# Altium schematic sheet TTL Clock.SchDoc: TTL Clock
size A3; Date: 14/10/2015; Author: Danius Kalvaitis; Engineer: Danius Kalvaitis; Address1: L3, 12a Rodborough Rd; Address2: Frenchs Forest; Address3: NSW; Address4: Australia 2086; DocumentNumber: 0002; Revision: C; SheetNumber: 1; SheetTotal: 1; PageSetup: Record=PageOptions|CenterHorizontal=True|CenterVertical=True|PrintScale=0.73|XCorrection=1.00|YCorrection=1.00|PrintKind=1|BorderSize=5000000|LeftOffset=0|BottomOffset=0|Orientation=2|PaperLength=1000|PaperWidth=1000|Scale=100|PaperSource=15|PrintQuality=600|MediaType=1|DitherType=10|PrintScaleMode=1|PaperKind=A4|PaperIndex=9
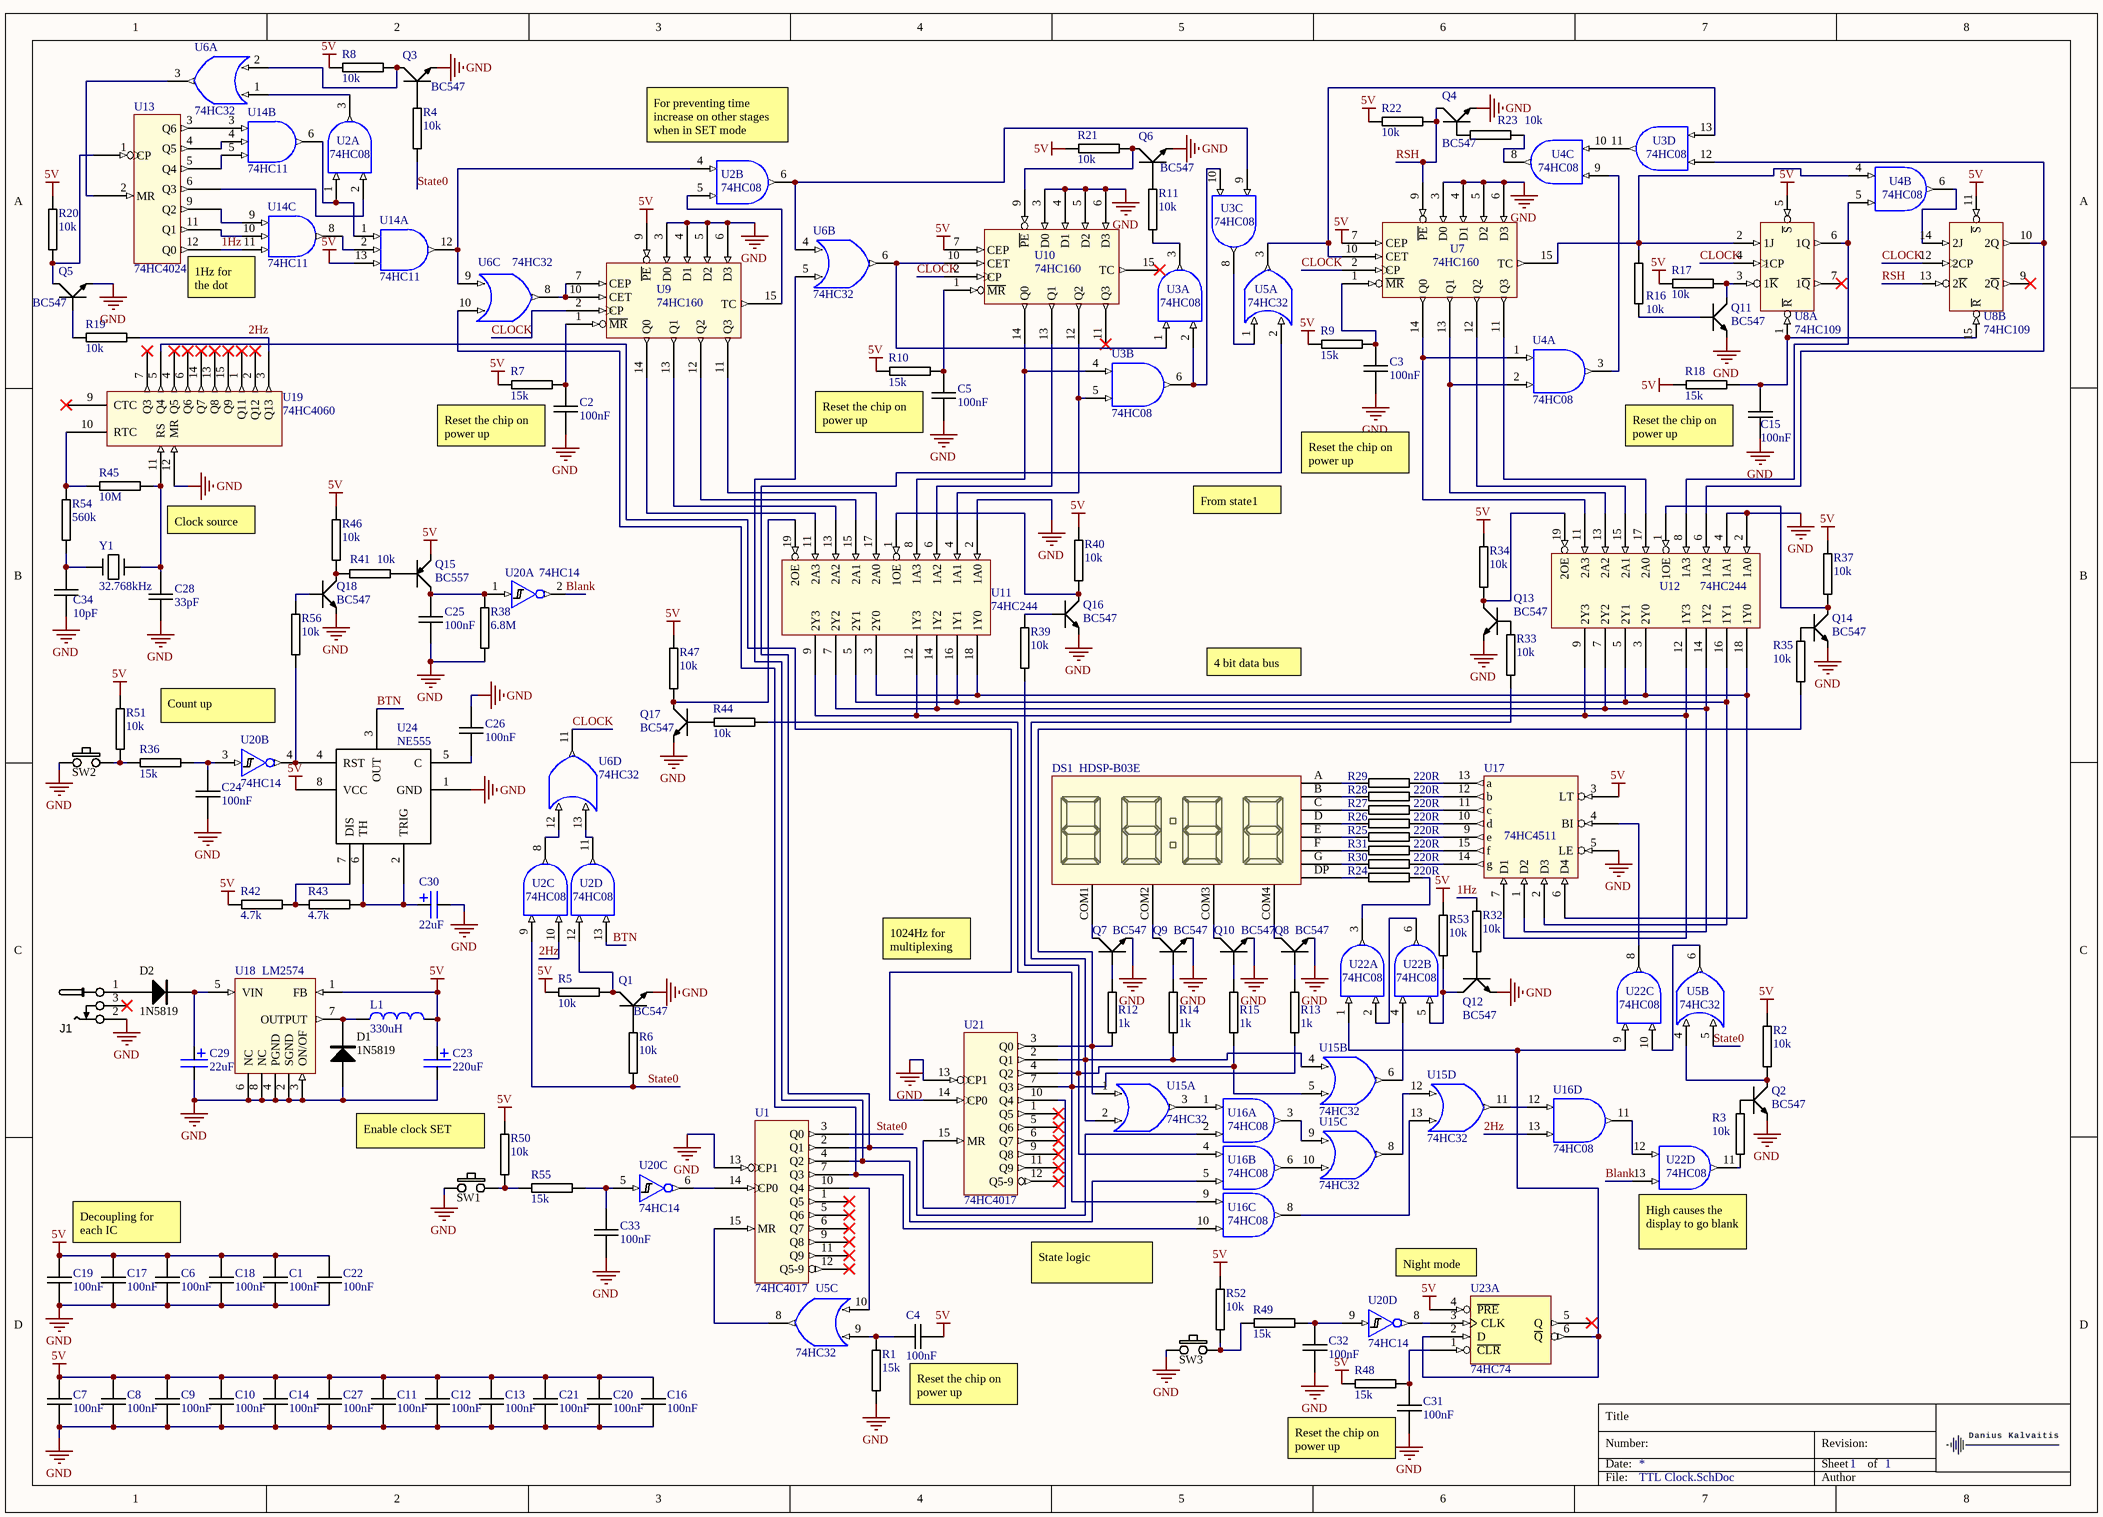
[diagram p0: TTL Clock.SchDoc]

## Parts
C1  100nF  [CTH radial 100mil]
C2  100nF  [CTH radial 100mil]
C3  100nF  [CTH radial 100mil]
C4  100nF  [CTH radial 100mil]
C5  100nF  [CTH radial 100mil]
C6  100nF  [CTH radial 100mil]
C7  100nF  [CTH radial 100mil]
C8  100nF  [CTH radial 100mil]
C9  100nF  [CTH radial 100mil]
C10  100nF  [CTH radial 100mil]
C11  100nF  [CTH radial 100mil]
C12  100nF  [CTH radial 100mil]
C13  100nF  [CTH radial 100mil]
C14  100nF  [CTH radial 100mil]
C15  100nF  [CTH radial 100mil]
C16  100nF  [CTH radial 100mil]
C17  100nF  [CTH radial 100mil]
C18  100nF  [CTH radial 100mil]
C19  100nF  [CTH radial 100mil]
C20  100nF  [CTH radial 100mil]
C21  100nF  [CTH radial 100mil]
C22  100nF  [CTH radial 100mil]
C23  220uF  [C_POL_Radial_220uF]
C24  100nF  [CTH radial 100mil]
C25  100nF  [CTH radial 100mil]
C26  100nF  [CTH radial 100mil]
C27  100nF  [CTH radial 100mil]
C28  33pF  [CTH radial 100mil]
C29  22uF  [C_Pol_Radial_22uF]
C30  22uF  [C_Pol_Radial_22uF]
C31  100nF  [CTH radial 100mil]
C32  100nF  [CTH radial 100mil]
C33  100nF  [CTH radial 100mil]
C34  10pF  [CTH radial 100mil]
D1  1N5819  [1N500X]
D2  1N5819  [1N500X]
DS1  HDSP-B03E  [LED DISPLAY 4x7seg clock red]
J1  CONN_PWR_JACK_2.1x5.5mm  [CONN_PWR_JACK_2.1x5.5mm]  (value not drawn)
L1  330uH  [ELC10D inductor]
Q1  BC547  [TO92]
Q2  BC547  [TO92]
Q3  BC547  [TO92]
Q4  BC547  [TO92]
Q5  BC547  [TO92]
Q6  BC547  [TO92]
Q7  BC547  [TO92]
Q8  BC547  [TO92]
Q9  BC547  [TO92]
Q10  BC547  [TO92]
Q11  BC547  [TO92]
Q12  BC547  [TO92]
Q13  BC547  [TO92]
Q14  BC547  [TO92]
Q15  BC557  [TO92]
Q16  BC547  [TO92]
Q17  BC547  [TO92]
Q18  BC547  [TO92]
R1  15k  [R-vertical]
R2  10k  [R-vertical]
R3  10k  [R-vertical]
R4  10k  [R-vertical]
R5  10k  [R-vertical]
R6  10k  [R-vertical]
R7  15k  [R-vertical]
R8  10k  [R-vertical]
R9  15k  [R-vertical]
R10  15k  [R-vertical]
R11  10k  [R-vertical]
R12  1k  [R-vertical]
R13  1k  [R-vertical]
R14  1k  [R-vertical]
R15  1k  [R-vertical]
R16  10k  [R-vertical]
R17  10k  [R-vertical]
R18  15k  [R-vertical]
R19  10k  [R-vertical]
R20  10k  [R-vertical]
R21  10k  [R-vertical]
R22  10k  [R-vertical]
R23  10k  [R-vertical]
R24  220R  [THR1/4-GENERIC]
R25  220R  [THR1/4-GENERIC]
R26  220R  [THR1/4-GENERIC]
R27  220R  [THR1/4-GENERIC]
R28  220R  [THR1/4-GENERIC]
R29  220R  [THR1/4-GENERIC]
R30  220R  [THR1/4-GENERIC]
R31  220R  [THR1/4-GENERIC]
R32  10k  [R-vertical]
R33  10k  [R-vertical]
R34  10k  [R-vertical]
R35  10k  [R-vertical]
R36  15k  [R-vertical]
R37  10k  [R-vertical]
R38  6.8M  [R-vertical]
R39  10k  [R-vertical]
R40  10k  [R-vertical]
R41  10k  [R-vertical]
R42  4.7k  [R-vertical]
R43  4.7k  [R-vertical]
R44  10k  [R-vertical]
R45  10M  [R-vertical]
R46  10k  [R-vertical]
R47  10k  [R-vertical]
R48  15k  [R-vertical]
R49  15k  [R-vertical]
R50  10k  [R-vertical]
R51  10k  [R-vertical]
R52  10k  [R-vertical]
R53  10k  [R-vertical]
R54  560k  [R-vertical]
R55  15k  [R-vertical]
R56  10k  [R-vertical]
SW1  SW-PB  [SW-PB-6x6-20]  (value not drawn)
SW2  SW-PB  [SW-PB-6x6-20]  (value not drawn)
SW3  SW-PB  [SW-PB-6x6-20]  (value not drawn)
U1  74HC4017  [DIP16]
U2  74HC08  [DIP14]  (parts A,B,C,D of 4)
U3  74HC08  [DIP14]  (parts A,B,C,D of 4)
U4  74HC08  [DIP14]  (parts A,B,C of 4)
U5  74HC32  [DIP14]  (parts A,B,C of 4)
U6  74HC32  [DIP14]  (parts A,B,C,D of 4)
U7  74HC160  [DIP16]
U8  74HC109  [DIP16]  (parts A,B of 2)
U9  74HC160  [DIP16]
U10  74HC160  [DIP16]
U11  74HC244  [DIP20]
U12  74HC244  [DIP20]
U13  74HC4024  [DIP14]
U14  74HC11  [DIP14]  (parts A,B,C of 3)
U15  74HC32  [DIP14]  (parts A,B,C,D of 4)
U16  74HC08  [DIP14]  (parts A,B,C,D of 4)
U17  74HC4511  [DIP16]
U18  LM2574  [DIP8]
U19  74HC4060  [DIP16]
U20  74HC14  [DIP14]  (parts A,B,C,D of 6)
U21  74HC4017  [DIP16]
U22  74HC08  [DIP14]  (parts A,B,C,D of 4)
U23  74HC74  [DIP14]  (part A of 2)
U24  NE555  [DIP8]
Y1  32.768kHz  [XTAL through hole]

## Nets
5V: C1.2 C4.1 C6.2 C7.2 C8.2 C9.2 C10.2 C11.2 C12.2 C13.2 C14.2 C16.2 C17.2 C18.2 C19.2 C20.2 C21.2 C22.2 C23.1 C27.2 L1.2 Q15.3(E) R2.1 R5.1 R7.1 R8.1 R9.1 R10.1 R17.1 R18.2 R20.1 R21.1 R22.1 R34.1 R37.1 R40.1 R42.2 R46.1 R47.1 R48.1 R50.1 R51.1 R52.1 R53.1 U1.16(5V) U2.14(5V) U3.14(5V) U4.14(5V) U5.14(5V) U6.14(5V) U7.7(CEP) U7.16(5V) U8.5(~{S}) U8.11(~{S}) U8.16(5V) U9.9(~{PE}) U9.16(5V) U10.7(CEP) U10.16(5V) U11.20(5V) U12.20(5V) U13.14(5V) U14.13 U14.14(5V) U15.14(5V) U16.14(5V) U17.3(LT) U17.16(5V) U18.1(FB) U19.16(5V) U20.14(5V) U21.16(5V) U22.14(5V) U23.4(~{PRE}) U23.14(5V) U24.8(VCC)
GND: C1.1 C2.1 C3.1 C5.1 C6.1 C7.1 C8.1 C9.1 C10.1 C11.1 C12.1 C13.1 C14.1 C15.2 C16.1 C17.1 C18.1 C19.1 C20.1 C21.1 C22.1 C23.2 C24.1 C25.2 C26.2 C27.1 C28.2 C29.2 C30.2 C31.1 C32.1 C33.1 C34.2 D1.A J1.2 Q1.3(E) Q2.3(E) Q3.3(E) Q4.3(E) Q5.3(E) Q6.3(E) Q7.3(E) Q8.3(E) Q9.3(E) Q10.3(E) Q11.3(E) Q12.3(E) Q13.3(E) Q14.3(E) Q16.3(E) Q17.3(E) Q18.3(E) R1.1 R38.1 SW1.1 SW2.1 SW3.1 U1.8(GND) U1.13(CP1) U2.7(GND) U3.7(GND) U4.7(GND) U5.7(GND) U6.7(GND) U7.3(D0) U7.4(D1) U7.5(D2) U7.6(D3) U7.8(GND) U8.8(GND) U9.3(D0) U9.4(D1) U9.5(D2) U9.6(D3) U9.8(GND) U10.3(D0) U10.4(D1) U10.5(D2) U10.6(D3) U10.8(GND) U11.2(1A0) U11.10(GND) U12.2(1A0) U12.4(1A1) U12.10(GND) U13.7(GND) U14.7(GND) U15.7(GND) U16.7(GND) U17.5(LE) U17.8(GND) U18.2(SGND) U18.3(ON/OF) U18.4(PGND) U18.6(NC) U18.8(NC) U19.8(GND) U19.12(MR) U20.7(GND) U21.8(GND) U21.13(CP1) U22.7(GND) U23.7(GND) U24.1(GND)
1Hz: R32.2 U13.12(Q0) U14.11
2Hz: R19.2 U2.10(B) U16.13(B) U19.3(Q13)
Blank: U20.2(Y) U22.13(B)
BTN: U2.13(B) U24.3(OUT)
CLOCK: U6.11 U7.2(CP) U8.4(1CP) U8.12(2CP) U9.2(CP) U10.2(CP)
RSH: Q4.1(C) R22.2 U7.9(~{PE}) U8.13(2~{K})
State0: R4.2 R6.2 U1.3(Q0) U2.9(A) U5.5
NetC2_2: C2.2 R7.2 U9.1(~{MR})
NetC3_2: C3.2 R9.2 U7.1(~{MR})
NetC4_2: C4.2 R1.2 U5.9
NetC5_2: C5.2 R10.2 U10.1(~{MR})
NetC15_1: C15.1 R18.1 U8.1(~{R}) U8.15(~{R})
NetC24_2: C24.2 R36.2 U20.3(A)
NetC25_1: C25.1 Q15.1(C) R38.2 U20.1(A)
NetC26_1: C26.1 U24.5(C)
NetC28_1: C28.1 R45.2 U19.11(RS) Y1.2
NetC29_1: C29.1 D2.K U18.5(VIN)
NetC30_1: C30.1 R43.1 U24.2(TRIG) U24.6(TH)
NetC31_2: C31.2 R48.2 U23.1(~{CLR})
NetC32_2: C32.2 R49.2 U20.9(A)
NetC33_2: C33.2 R55.2 U20.5(A)
NetC34_1: C34.1 R54.1 Y1.1
NetD1_K: D1.K L1.1 U18.7(OUTPUT)
NetD2_A: D2.A J1.1
NetDS1_A: DS1.A R29.2
NetDS1_B: DS1.B R28.2
NetDS1_C: DS1.C R27.2
NetDS1_COM1: DS1.COM1 Q7.1(C)
NetDS1_COM2: DS1.COM2 Q9.1(C)
NetDS1_COM3: DS1.COM3 Q10.1(C)
NetDS1_COM4: DS1.COM4 Q8.1(C)
NetDS1_D: DS1.D R26.2
NetDS1_DP: DS1.DP R24.2
NetDS1_E: DS1.E R25.2
NetDS1_F: DS1.F R31.2
NetDS1_G: DS1.G R30.2
NetQ1_1: Q1.1(C) R5.2 U2.12(A)
NetQ1_2: Q1.2(B) R6.1
NetQ2_1: Q2.1(C) R2.2 U5.4
NetQ2_2: Q2.2(B) R3.1
NetQ3_1: Q3.1(C) R8.2 U6.2
NetQ3_2: Q3.2(B) R4.1
NetQ4_2: Q4.2(B) R23.1
NetQ5_1: Q5.1(C) R20.2 U13.1(CP)
NetQ5_2: Q5.2(B) R19.1
NetQ6_1: Q6.1(C) R21.2 U10.9(~{PE})
NetQ6_2: Q6.2(B) R11.1
NetQ7_2: Q7.2(B) R12.1
NetQ8_2: Q8.2(B) R13.1
NetQ9_2: Q9.2(B) R14.1
NetQ10_2: Q10.2(B) R15.1
NetQ11_1: Q11.1(C) R17.2 U8.3(1~{K})
NetQ11_2: Q11.2(B) R16.1
NetQ12_1: Q12.1(C) R53.2 U22.5(B)
NetQ12_2: Q12.2(B) R32.1
NetQ13_1: Q13.1(C) R34.2 U12.19(2OE)
NetQ13_2: Q13.2(B) R33.2
NetQ14_1: Q14.1(C) R37.2 U12.1(1OE)
NetQ14_2: Q14.2(B) R35.1
NetQ15_2: Q15.2(B) R41.2
NetQ16_1: Q16.1(C) R40.2 U11.1(1OE)
NetQ16_2: Q16.2(B) R39.1
NetQ17_1: Q17.1(C) R47.2 U11.19(2OE)
NetQ17_2: Q17.2(B) R44.1
NetQ18_1: Q18.1(C) R41.1 R46.2
NetQ18_2: Q18.2(B) R56.1
NetR3_2: R3.2 U22.11(Y)
NetR11_2: R11.2 U3.3(Y)
NetR12_2: R12.2 R35.2 U15.1 U21.3(Q0)
NetR13_2: R13.2 R44.2 U16.9(A) U21.7(Q3)
NetR14_2: R14.2 R33.1 U15.2 U15.4 U21.2(Q1)
NetR15_2: R15.2 R39.2 U15.5 U16.4(A) U21.4(Q2)
NetR16_2: R16.2 U4.4(A) U7.15(TC) U8.2(1J)
NetR23_2: R23.2 U4.8(Y)
NetR24_1: R24.1 U22.3(Y)
NetR25_1: R25.1 U17.9(e)
NetR26_1: R26.1 U17.10(d)
NetR27_1: R27.1 U17.11(c)
NetR28_1: R28.1 U17.12(b)
NetR29_1: R29.1 U17.13(a)
NetR30_1: R30.1 U17.14(g)
NetR31_1: R31.1 U17.15(f)
NetR36_1: R36.1 R51.2 SW2.2
NetR42_1: R42.1 R43.2 U24.7(DIS)
NetR45_1: R45.1 R54.2 U19.10(RTC)
NetR49_1: R49.1 R52.2 SW3.2
NetR50_2: R50.2 R55.1 SW1.2
NetR56_2: R56.2 U20.4(Y) U24.4(RST)
NetU1_2: U1.2(Q1) U5.2 U16.2(B)
NetU1_4: U1.4(Q2) U6.5 U16.5(B)
NetU1_7: U1.7(Q3) U6.10 U16.10(B)
NetU1_10: U1.10(Q4) U5.10
NetU1_14: U1.14(CP0) U20.6(Y)
NetU1_15: U1.15(MR) U5.8
NetU2_1: U2.1(A) U14.1 U14.6
NetU2_2: U2.2(B) U13.6(Q3)
NetU2_3: U2.3(Y) U6.1
NetU2_4: U2.4(A) U6.9 U14.12
NetU2_5: U2.5(B) U9.15(TC)
NetU2_6: U2.6(Y) U3.9(A) U6.4
NetU2_8: U2.8(Y) U6.12
NetU2_11: U2.11(Y) U6.13
NetU3_1: U3.1(A) U6.6 U10.10(CET)
NetU3_2: U3.2(B) U3.6(Y) U3.10(B)
NetU3_4: U3.4(A) U10.14(Q0) U11.8(1A3)
NetU3_5: U3.5(B) U10.12(Q2) U11.4(1A1)
NetU3_8: U3.8(Y) U5.1
NetU3_11: U3.11(Y) U4.10(B)
NetU3_12: U3.12(A) U8.10(2Q) U12.6(1A2)
NetU3_13: U3.13(B) U5.3 U7.10(CET)
NetU4_1: U4.1(A) U7.14(Q0) U12.11(2A3)
NetU4_2: U4.2(B) U7.13(Q1) U12.13(2A2)
NetU4_3: U4.3(Y) U4.9(A)
NetU4_5: U4.5(B) U8.6(1Q) U12.8(1A3)
NetU4_6: U4.6(Y) U8.14(2J)
NetU5_6: U5.6 U22.10(B)
NetU6_3: U6.3 U13.2(MR)
NetU6_8: U6.8 U9.7(CEP) U9.10(CET)
NetU7_11: U7.11(Q3) U12.17(2A0)
NetU7_12: U7.12(Q2) U12.15(2A1)
NetU9_11: U9.11(Q3) U11.17(2A0)
NetU9_12: U9.12(Q2) U11.15(2A1)
NetU9_13: U9.13(Q1) U11.13(2A2)
NetU9_14: U9.14(Q0) U11.11(2A3)
NetU10_13: U10.13(Q1) U11.6(1A2)
NetU11_3: U11.3(2Y0) U11.18(1Y0) U12.3(2Y0) U12.18(1Y0) U17.6(D4)
NetU11_5: U11.5(2Y1) U11.16(1Y1) U12.5(2Y1) U12.16(1Y1) U17.2(D3)
NetU11_7: U11.7(2Y2) U11.14(1Y2) U12.7(2Y2) U12.14(1Y2) U17.1(D2)
NetU11_9: U11.9(2Y3) U11.12(1Y3) U12.9(2Y3) U12.12(1Y3) U17.7(D1)
NetU13_3: U13.3(Q6) U14.3
NetU13_4: U13.4(Q5) U14.4
NetU13_5: U13.5(Q4) U14.5
NetU13_9: U13.9(Q2) U14.9
NetU13_11: U13.11(Q1) U14.10
NetU14_2: U14.2 U14.8
NetU15_3: U15.3 U16.1(A)
NetU15_6: U15.6 U22.4(A)
NetU15_8: U15.8 U15.12
NetU15_9: U15.9 U16.3(Y)
NetU15_10: U15.10 U16.6(Y)
NetU15_11: U15.11 U16.12(A)
NetU15_13: U15.13 U16.8(Y)
NetU16_11: U16.11(Y) U22.12(A)
NetU17_4: U17.4(BI) U22.8(Y)
NetU19_5: U19.5(Q4) U21.14(CP0)
NetU20_8: U20.8(Y) U23.3(CLK)
NetU21_10: U21.10(Q4) U21.15(MR)
NetU22_1: U22.1(A) U22.9(A) U23.2(D) U23.6(~{Q})
NetU22_2: U22.2(B) U22.6(Y)

Not connected (* = marked no-connect by the designer): J1 3*; U1 1(Q5)* 5(Q6)* 6(Q7)* 9(Q8)* 11(Q9)* 12(Q5-9)*; U8 7(1~{Q})* 9(2~{Q})*; U10 11(Q3)* 15(TC)*; U19 1(Q11)* 2(Q12)* 4(Q5)* 6(Q6)* 7(Q3)* 9(CTC)* 13(Q8)* 14(Q7)* 15(Q9)*; U21 1(Q5)* 5(Q6)* 6(Q7)* 9(Q8)* 11(Q9)* 12(Q5-9)*; U23 5(Q)*

## Notes on the sheet
- (near U2) For preventing time increase on other stages when in SET mode
- 1Hz for the dot
- Reset the chip on power up
- From state1
- (near C3) Reset the chip on power up
- Clock source
- Count up
- 4 bit data bus
- 1024Hz for multiplexing
- (near R50) Enable clock SET
- Decoupling for each IC
- Night mode
- (near U22) High causes the display to go blank
- State logic
- (near C31) Reset the chip on power up
- Title
- Date:
- Number:
- Revision:
- Sheet
- of
- File:
- Author

## Library data of the parts
C1-C22 C24-C28 C31-C34 = Capacitor radial TH 100mil: Ceramic capacitor through hole 100mil pitch
  C1-C22 C24-C27 C31-C33: Capacitance: 100nF; Specifications: 100nF
  C28: Capacitance: 33pF; Specifications: 33pF
  C34: Capacitance: 10pF; Specifications: 10pF
C23 C29 C30 = CapPol: Capacitor polarised
  C23: Capacitance: 220uF; Specifications: 220uF
  C29 C30: Capacitance: 22uF; Specifications: 22uF
D1 D2 = 1N5819: Schottky Diodes & Rectifiers 40V 1A; Specifications: 1A 40V; ComponentLink1Description: Datasheet; ComponentLink1URL: https://eu.mouser.com/datasheet/2/345/1n5817-1n5819-24580.pdf
DS1 = HDSP-B03E: LED Displays & Accessories 88:88 Clock Module 0.56in 4 Digits CC; ComponentLink1Description: Datasheet; ComponentLink1URL: https://www.broadcom.com/products/leds-and-displays/7-segment/through-hole/hdsp-b03e
J1 = CONN_PWR_JACK_2.1x5.5mm: Power Connector, THT, 2.1mm ID, 5.5mm OD; ComponentLink1Description: Datasheet; ComponentLink1URL: https://www.cui.com/product/resource/pj-102ah.pdf
L1 = ELC09D331F: Fixed Inductors 330uH 10% 46A Radial Choke Coil; Inductance: 330uH; Specifications: 330uH; ComponentLink1Description: Datasheet; ComponentLink1URL: https://eu.mouser.com/datasheet/2/315/AGB0000C1-1108071.pdf
Q1-Q14 Q16-Q18 = BC547: Bipolar Transistors - BJT NPN 45V 100mA HFE/800; ComponentLink1Description: Datasheet; ComponentLink1URL: https://eu.mouser.com/datasheet/2/308/BC547-1118654.pdf
Q15 = BC557: Bipolar Transistors - BJT PNP -45V -100mA HFE/220; ComponentLink1Description: Datasheet; ComponentLink1URL: https://eu.mouser.com/datasheet/2/308/BC557-1118720.pdf
R1-R56 = R-THR1/4-GENERIC: GENERIC THROUGH HOLE 1/4 WATT RESISTOR
  R1 R7 R9 R10 R18 R36 R48 R49 R55: Resistance: 15k; Specifications: 15k
  R2-R6 R8 R11 R16 R17 R19-R23 R32-R35 R37 R39-R41 R44 R46 R47 R50-R53 R56: Resistance: 10k; Specifications: 10k
  R12-R15: Resistance: 1k; Specifications: 1k
  R24-R31: Resistance: 220R; Specifications: 220R
  R38: Resistance: 6.8M; Specifications: 6.8M
  R42 R43: Resistance: 4.7k; Specifications: 4.7k
  R45: Resistance: 10M; Specifications: 10M
  R54: Resistance: 560k; Specifications: 560k
SW1-SW3 = SW-PB-6x6-20: Switch push-button 6x6mm 20mm height
U1 U21 = 74HC4017: Johnson decade counter with 10 decoded outputs; ComponentLink1Description: Datasheet; ComponentLink1URL: http://www.ti.com/lit/ds/symlink/cd74hc4017.pdf
U2-U4 U16 U22 = 74HC08: Quadruple 2-Input Positive-AND Gate; ComponentLink1Description: Datasheet; ComponentLink1URL: http://www.ti.com/lit/ds/symlink/sn74hc08.pdf
U5 U6 U15 = 74HC32: IC GATE OR 4CH 2-INP 14DIP; ComponentLink1Description: Datasheet; ComponentLink1URL: http://www.ti.com/lit/ds/symlink/sn74hc32.pdf
U7 U9 U10 = 74HC160: Presettable synchronous BCD  decade counter; asynchronous  reset; ComponentLink1Description: Datasheet; ComponentLink1URL: https://assets.nexperia.com/documents/data-sheet/74HC160.pdf
U8 = 74HC109: Dual JK flip-flop with set and reset, positive edge clk; ComponentLink1Description: Datasheet; ComponentLink1URL: http://www.ti.com/lit/ds/symlink/sn74hc109.pdf
U11 U12 = 74HC244: Octal buffer/line driver; 3-state; ComponentLink1Description: Datasheet; ComponentLink1URL: http://www.ti.com/lit/ds/symlink/sn74hc244.pdf
U13 = 74HC4024: 7-stage binary ripple counter; ComponentLink1Description: Datasheet; ComponentLink1URL: http://www.ti.com/lit/ds/symlink/cd74hc4024.pdf
U14 = 74HC11: Triple 3-input AND gate; ComponentLink1Description: Datasheet; ComponentLink1URL: http://www.ti.com/lit/ds/symlink/sn74hc11.pdf
U17 = 74HC4511: IC DRVR 7 SEGMENT 1 DIGIT 16DIP; ComponentLink1Description: Datasheet; ComponentLink1URL: http://www.ti.com/lit/ds/symlink/cd74hc4511.pdf
U18 = LM2574: Buck, Boost, Buck-Boost Switching Regulator IC Positive or Negative Fixed 5V 1 Output 500mA 8-DIP (0.300", 7.62mm); ComponentLink1Description: Datasheet; ComponentLink1URL: https://media.digikey.com/pdf/Data%20Sheets/ON%20Semiconductor%20PDFs/LM2574.pdf
U19 = 74HC4060: 14-stage binary ripple counter with oscillator
U20 = 74HC14: IC INVERTER SCHMITT 6CH 14DIP; ComponentLink1Description: Datasheet; ComponentLink1URL: https://media.digikey.com/pdf/Data%20Sheets/Toshiba%20PDFs/TC74HC14.pdf
U23 = 74HC74: IC FF D-TYPE DUAL 1BIT 14DIP; ComponentLink1Description: Datasheet; ComponentLink1URL: http://www.ti.com/lit/ds/symlink/sn74hc74.pdf
U24 = NE555: 555 Type, Timer/Oscillator (Single) IC 100kHz 8-PDIP; ComponentLink1Description: Datasheet; ComponentLink1URL: http://www.ti.com/lit/ds/symlink/ne555.pdf
Y1 = AB26T-32.768KHZ: Crystal Oscillator 32.768kHz; Frequency: 32.768kHz; Specifications: 32.768kHz; ComponentLink1Description: Datasheet; ComponentLink1URL: https://abracon.com/Resonators/AB26T.pdf